# Altium schematic sheet Sensor.SchDoc
size A4; SheetNumber: 2; SheetTotal: 7
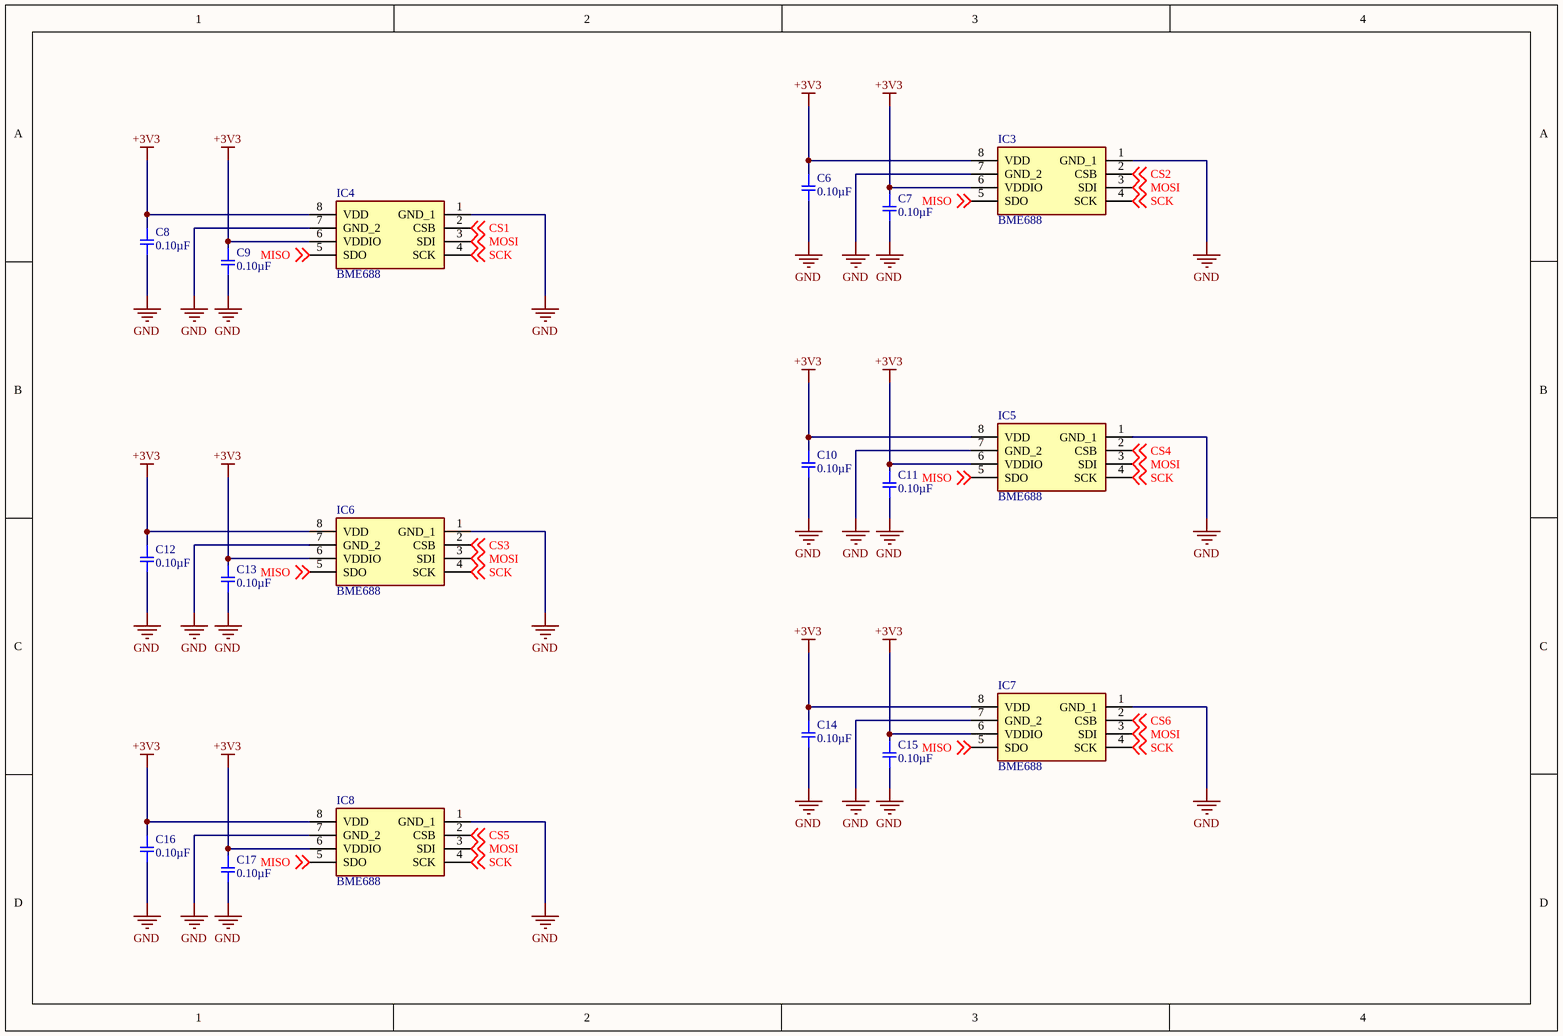
[diagram p0: Sensor.SchDoc]

## Parts
C6  0.10µF  [SMD-0402C]
C7  0.10µF  [SMD-0402C]
C8  0.10µF  [SMD-0402C]
C9  0.10µF  [SMD-0402C]
C10  0.10µF  [SMD-0402C]
C11  0.10µF  [SMD-0402C]
C12  0.10µF  [SMD-0402C]
C13  0.10µF  [SMD-0402C]
C14  0.10µF  [SMD-0402C]
C15  0.10µF  [SMD-0402C]
C16  0.10µF  [SMD-0402C]
C17  0.10µF  [SMD-0402C]
IC3  BME688  [BME688]
IC4  BME688  [BME688]
IC5  BME688  [BME688]
IC6  BME688  [BME688]
IC7  BME688  [BME688]
IC8  BME688  [BME688]

## Nets
+3V3: C6.1 C7.1 C8.1 C9.1 C10.1 C11.1 C12.1 C13.1 C14.1 C15.1 C16.1 C17.1 IC3.6(VDDIO) IC3.8(VDD) IC4.6(VDDIO) IC4.8(VDD) IC5.6(VDDIO) IC5.8(VDD) IC6.6(VDDIO) IC6.8(VDD) IC7.6(VDDIO) IC7.8(VDD) IC8.6(VDDIO) IC8.8(VDD)
GND: C6.2 C7.2 C8.2 C9.2 C10.2 C11.2 C12.2 C13.2 C14.2 C15.2 C16.2 C17.2 IC3.1(GND_1) IC3.7(GND_2) IC4.1(GND_1) IC4.7(GND_2) IC5.1(GND_1) IC5.7(GND_2) IC6.1(GND_1) IC6.7(GND_2) IC7.1(GND_1) IC7.7(GND_2) IC8.1(GND_1) IC8.7(GND_2)
CS1: IC4.2(CSB) ; off-sheet CS1
CS2: IC3.2(CSB) ; off-sheet CS2
CS3: IC6.2(CSB) ; off-sheet CS3
CS4: IC5.2(CSB) ; off-sheet CS4
CS5: IC8.2(CSB) ; off-sheet CS5
CS6: IC7.2(CSB) ; off-sheet CS6
MISO: IC3.5(SDO) IC4.5(SDO) IC5.5(SDO) IC6.5(SDO) IC7.5(SDO) IC8.5(SDO) ; off-sheet MISO
MOSI: IC3.3(SDI) IC4.3(SDI) IC5.3(SDI) IC6.3(SDI) IC7.3(SDI) IC8.3(SDI) ; off-sheet MOSI
SCK: IC3.4(SCK) IC4.4(SCK) IC5.4(SCK) IC6.4(SCK) IC7.4(SCK) IC8.4(SCK) ; off-sheet SCK

## Library data of the parts
C6-C17 = GCM155R71C104KA55D: CAP CER 0.1UF 16V X7R 0402; Manufacturer: Murata Electronics North America; Factory Stock: 0; Unit Price (USD): 0.1; Minimum Quantity: 1; Tolerance: ±10%; Datasheets: http://www.murata.com/~/media/webrenewal/support/library/catalog/products/capacitor/mlcc/c03e.ashx; Image: //media.digikey.com/Renders/Murata%20Renders/ZRB-SERIES-0402.jpg; Digi-Key Part Number: 490-4759-1-ND; Part Number: GCM155R71C104KA55D; Quantity Available: 734194; @ qty: 0; Packaging: Cut Tape (CT); Series: GCM; Part Status: Active; Value: 0.10µF; Voltage: 16V; Temperature Coefficient: X7R; Operating Temperature: -55°C ~ 125°C; Features: -; Ratings: AEC-Q200; Applications: Automotive; Mounting Type: Surface Mount, MLCC; Package / Case: 0402 (1005 Metric); Size / Dimension: 0.039" L x 0.020" W (1.00mm x 0.50mm); Height - Seated (Max): -; Thickness (Max): 0.022" (0.55mm); Lead Spacing: -; Lead Style: -
IC3-IC8 = BME688: Integrated Circuit; Manufacturer_Name: BOSCH; Datasheet Link: https://www.bosch-sensortec.com/media/boschsensortec/downloads/datasheets/bst-bme688-ds000.pdf; Height: 1mm; Manufacturer_Part_Number: BME688; Mouser Part Number: 262-BME688; Mouser Price/Stock: https://www.mouser.co.uk/ProductDetail/Bosch-Sensortec/BME688?qs=IS%252B4QmGtzzqQoVDscqwx3A%3D%3D; Arrow Part Number: BME688; Arrow Price/Stock: https://www.arrow.com/en/products/bme688/bosch?region=europe